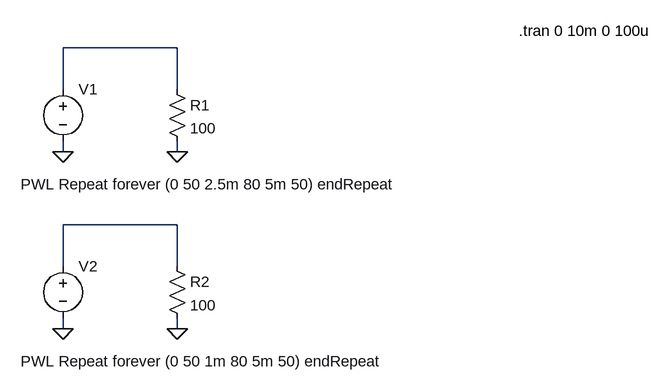
[diagram p0: schematic TriangularWithOffset.asc]
TriangularWithOffset.asc, the LTspice schematic file:
Version 4
SHEET 1 1072 680
WIRE 320 16 144 16
WIRE 144 80 144 16
WIRE 320 80 320 16
WIRE 144 176 144 160
WIRE 320 176 320 160
WIRE 320 288 144 288
WIRE 144 352 144 288
WIRE 320 352 320 288
WIRE 144 448 144 432
WIRE 320 448 320 432
FLAG 144 176 0
FLAG 320 176 0
FLAG 144 448 0
FLAG 320 448 0
SYMBOL voltage 144 64 R0
WINDOW 3 -65 162 Left 2
SYMATTR InstName V1
SYMATTR Value PWL Repeat forever (0 50 2.5m 80 5m 50) endRepeat
SYMBOL res 304 64 R0
SYMATTR InstName R1
SYMATTR Value 100
SYMBOL voltage 144 336 R0
WINDOW 3 -65 162 Left 2
SYMATTR InstName V2
SYMATTR Value PWL Repeat forever (0 50 1m 80 5m 50) endRepeat
SYMBOL res 304 336 R0
SYMATTR InstName R2
SYMATTR Value 100
TEXT 846 -10 Left 2 !.tran 0 10m 0 100u

The netlist it stands for:
* TriangularWithOffset.asc
V1 N001 0 PWL Repeat forever (0 50 2.5m 80 5m 50) endRepeat
R1 N001 0 100
V2 N002 0 PWL Repeat forever (0 50 1m 80 5m 50) endRepeat
R2 N002 0 100
.tran 0 10m 0 100u
.backanno
.end